# Altium schematic sheet E-scooter.SchDoc
size A4; Organization: Altium Limited; Address1: L3, 12a Rodborough Rd; Address2: Frenchs Forest; Address3: NSW; Address4: Australia 2086
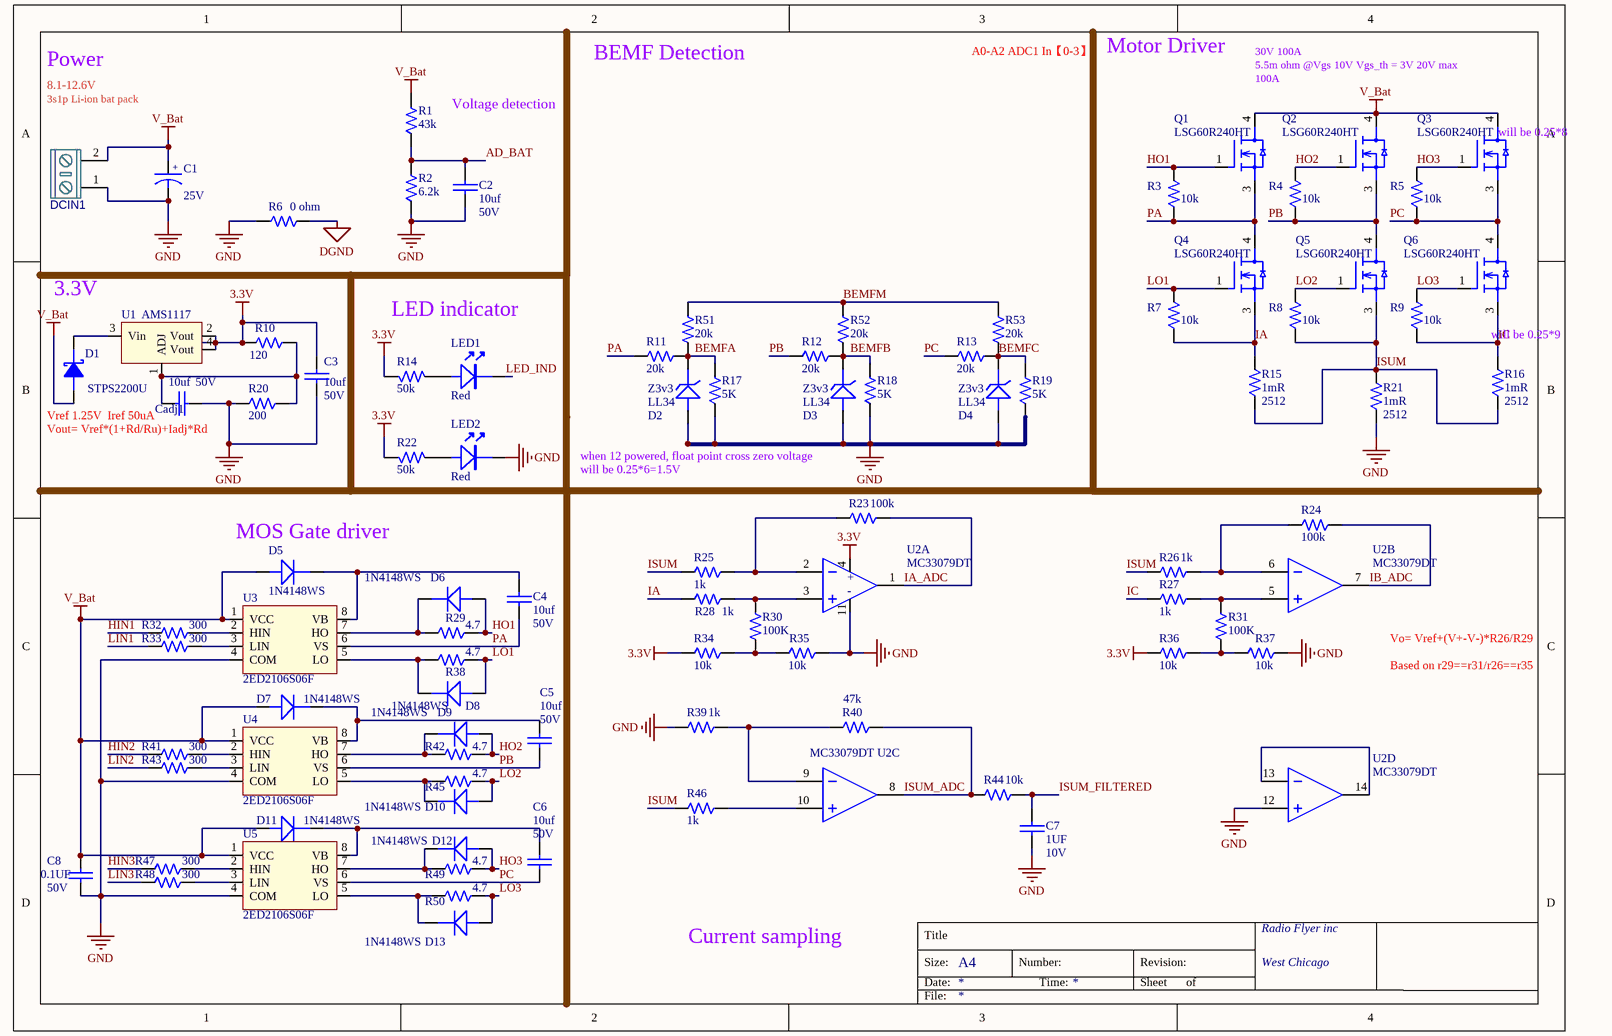
[diagram p0: E-scooter.SchDoc]

## Parts
C1  Voltage: 25V  [CASE - G]  (hidden comment: PBE099550-4710)
C2  value 10uf  Voltage: 50V  [CAPC0603-RW]  (hidden comment: PXL456470-1530)
C3  value 10uf  Voltage: 50V  [CAPC0603-RW]  (hidden comment: PXL456470-1530)
C4  value 10uf  Voltage: 50V  [CAPC0603-RW]  (hidden comment: PXL456470-1530)
C5  value 10uf  Voltage: 50V  [CAPC0603-RW]  (hidden comment: PXL456470-1530)
C6  value 10uf  Voltage: 50V  [CAPC0603-RW]  (hidden comment: PXL456470-1530)
C7  value 1UF  Voltage: 10V  [CAPC0603-SW]  (hidden comment: PXL456470-1530)
C8  value 0.1UF  Voltage: 50V  [CAPC0603-RW]  (hidden comment: PXL456470-1530)
Cadj1  value 10uf  Voltage: 50V  [CAPC0603-RW]  (hidden comment: PXL456470-1530)
D1  MFG Part: STPS2200U  [SMB]  (hidden comment: DIO STPS2200U)
D2  MFG Part: Z3v3  [LL34]  (hidden comment: RCZ005015-0020)
D3  MFG Part: Z3v3  [LL34]  (hidden comment: RCZ005015-0020)
D4  MFG Part: Z3v3  [LL34]  (hidden comment: RCZ005015-0020)
D5  RCD114148-0020  [SOD-323]  (value not drawn)
D6  RCD114148-0020  [SOD-323]  (value not drawn)
D7  RCD114148-0020  [SOD-323]  (value not drawn)
D8  RCD114148-0020  [SOD-323]  (value not drawn)
D9  RCD114148-0020  [SOD-323]  (value not drawn)
D10  RCD114148-0020  [SOD-323]  (value not drawn)
D11  RCD114148-0020  [SOD-323]  (value not drawn)
D12  RCD114148-0020  [SOD-323]  (value not drawn)
D13  RCD114148-0020  [SOD-323]  (value not drawn)
DCIN1  KF/WJ/DG 30x connecter  [KF/WJ/DG 301-2p-5.0mm]  (value not drawn)
LED1  Color: Red  [LED1206-RED]  (hidden comment: LED1206R_23-21\R6C-AM1N2AY\2A)
LED2  Color: Red  [LED1206-RED]  (hidden comment: LED1206R_23-21\R6C-AM1N2AY\2A)
Q1  MFG Part: LSG60R240HT  [TO252-3]  (hidden comment: T5860038503A6)
Q2  MFG Part: LSG60R240HT  [TO252-3]  (hidden comment: T5860038503A6)
Q3  MFG Part: LSG60R240HT  [TO252-3]  (hidden comment: T5860038503A6)
Q4  MFG Part: LSG60R240HT  [TO252-3]  (hidden comment: T5860038503A6)
Q5  MFG Part: LSG60R240HT  [TO252-3]  (hidden comment: T5860038503A6)
Q6  MFG Part: LSG60R240HT  [TO252-3]  (hidden comment: T5860038503A6)
R1  value 43k  [0603-RW]  (hidden comment: T5024421083A9)
R2  value 6.2k  [0603-RW]  (hidden comment: T5024421083A9)
R3  value 10k  [0603-RW]  (hidden comment: T5024421083A9)
R4  value 10k  [0603-RW]  (hidden comment: T5024421083A9)
R5  value 10k  [0603-RW]  (hidden comment: T5024421083A9)
R6  value 0 ohm  [0603-RW]  (hidden comment: T502210202399)
R7  value 10k  [0603-RW]  (hidden comment: T5024421083A9)
R8  value 10k  [0603-RW]  (hidden comment: T5024421083A9)
R9  value 10k  [0603-RW]  (hidden comment: T5024421083A9)
R10  value 120  [0603-RW]  (hidden comment: T5024421083A9)
R11  value 20k  [0603-RW]  (hidden comment: T5024421083A9)
R12  value 20k  [0603-RW]  (hidden comment: T5024421083A9)
R13  value 20k  [0603-RW]  (hidden comment: T5024421083A9)
R14  value 50k  [0603-RW]  (hidden comment: T5024421083A9)
R15  value 1mR  [2512]  (hidden comment: QCF101250-1009)
R16  value 1mR  [2512]  (hidden comment: QCF101250-1009)
R17  value 5K  [0603-RW]  (hidden comment: T5024421083A9)
R18  value 5K  [0603-RW]  (hidden comment: T5024421083A9)
R19  value 5K  [0603-RW]  (hidden comment: T5024421083A9)
R20  value 200  [0603-RW]  (hidden comment: T5024421083A9)
R21  value 1mR  [2512]  (hidden comment: QCF101250-1009)
R22  value 50k  [0603-RW]  (hidden comment: T5024421083A9)
R23  value 100k  [0603-RW]  (hidden comment: T5024421083A9)
R24  value 100k  [0603-RW]  (hidden comment: T5024421083A9)
R25  value 1k  [0603-RW]  (hidden comment: T5024421083A9)
R26  value 1k  [0603-RW]  (hidden comment: T5024421083A9)
R27  value 1k  [0603-RW]  (hidden comment: T5024421083A9)
R28  value 1k  [0603-RW]  (hidden comment: T5024421083A9)
R29  value 4.7  [0603-RW]  (hidden comment: T5024421083A9)
R30  value 100K  [0603-RW]  (hidden comment: T5024421083A9)
R31  value 100K  [0603-RW]  (hidden comment: T5024421083A9)
R32  value 300  [0603-RW]  (hidden comment: T5024421083A9)
R33  value 300  [0603-RW]  (hidden comment: T5024421083A9)
R34  value 10k  [0603-RW]  (hidden comment: T5024421083A9)
R35  value 10k  [0603-RW]  (hidden comment: T5024421083A9)
R36  value 10k  [0603-RW]  (hidden comment: T5024421083A9)
R37  value 10k  [0603-RW]  (hidden comment: T5024421083A9)
R38  value 4.7  [0603-RW]  (hidden comment: T5024421083A9)
R39  value 1k  [0603-RW]  (hidden comment: T5024421083A9)
R40  value 47k  [0603-RW]  (hidden comment: T5024421083A9)
R41  value 300  [0603-RW]  (hidden comment: T5024421083A9)
R42  value 4.7  [0603-RW]  (hidden comment: T5024421083A9)
R43  value 300  [0603-RW]  (hidden comment: T5024421083A9)
R44  value 10k  [0603-RW]  (hidden comment: T5024421083A9)
R45  value 4.7  [0603-RW]  (hidden comment: T5024421083A9)
R46  value 1k  [0603-RW]  (hidden comment: T5024421083A9)
R47  value 300  [0603-RW]  (hidden comment: T5024421083A9)
R48  value 300  [0603-RW]  (hidden comment: T5024421083A9)
R49  value 4.7  [0603-RW]  (hidden comment: T5024421083A9)
R50  value 4.7  [0603-RW]  (hidden comment: T5024421083A9)
R51  value 20k  [0603-RW]  (hidden comment: T5024421083A9)
R52  value 20k  [0603-RW]  (hidden comment: T5024421083A9)
R53  value 20k  [0603-RW]  (hidden comment: T5024421083A9)
U1  AMS1117  [SOT223]
U2  RCI033079-0002  [SO14]  (value not drawn)  (parts A,B,C,D of 4)
U3  T610900027257  [SO8]  (value not drawn)
U4  T610900027257  [SO8]  (value not drawn)
U5  T610900027257  [SO8]  (value not drawn)

## Nets
3.3V: C3.1 R10.2 R14.1 R22.1 R34.2 R36.2 U1.2(Vout) U1.4(Vout) U2.4(+V)
DGND: R6.2
GND: C1.2 C2.2 C3.2 C7.1 C8.1 Cadj1.2 D2.1(A) D3.1(A) D4.1(A) DCIN1.1 LED2.2(K) R2.2 R6.1 R17.2 R18.2 R19.2 R20.2 R21.1 R35.1 R37.1 R39.2 U2.11(-V) U2.12(IN+) U3.4(COM) U4.4(COM) U5.4(COM)
V_Bat: C1.1 C8.2 D1.1(A) D5.1(A) D7.1(A) D11.1(A) DCIN1.2 Q1.4(D) Q2.4(D) Q3.4(D) R1.1 U3.1(VCC) U4.1(VCC) U5.1(VCC)
AD_BAT: C2.1 R1.2 R2.1
BEMFA: D2.2(K) R11.1 R17.1 R51.2
BEMFB: D3.2(K) R12.1 R18.1 R52.2
BEMFC: D4.2(K) R13.1 R19.1 R53.2
BEMFM: R51.1 R52.1 R53.1
HIN1: R32.2
HIN2: R41.2
HIN3: R47.2
HO1: D6.1(A) Q1.1(G) R3.2 R29.1
HO2: D9.1(A) Q2.1(G) R4.2 R42.1
HO3: D12.1(A) Q3.1(G) R5.2 R49.1
IA: Q4.3(S) R7.1 R15.2 R28.2
IA_ADC: R23.1 U2.1(OUT)
IB_ADC: R24.1 U2.7(OUT)
IC: Q6.3(S) R9.1 R16.2 R27.2
ISUM: Q5.3(S) R8.1 R15.1 R16.1 R21.2 R25.2 R26.2 R46.2
ISUM_ADC: R40.1 R44.2 U2.8(OUT)
ISUM_FILTERED: C7.2 R44.1
LED_IND: LED1.2(K)
LIN1: R33.2
LIN2: R43.2
LIN3: R48.2
LO1: D8.1(A) Q4.1(G) R7.2 R38.1
LO2: D10.1(A) Q5.1(G) R8.2 R45.1
LO3: D13.1(A) Q6.1(G) R9.2 R50.1
PA: C4.1 Q1.3(S) Q4.4(D) R3.1 R11.2 U3.6(VS)
PB: C5.1 Q2.3(S) Q5.4(D) R4.1 R12.2 U4.6(VS)
PC: C6.1 Q3.3(S) Q6.4(D) R5.1 R13.2 U5.6(VS)
NetC4_2: C4.2 D5.2(K) U3.8(VB)
NetC5_2: C5.2 D7.2(K) U4.8(VB)
NetC6_2: C6.2 D11.2(K) U5.8(VB)
NetCadj1_1: Cadj1.1 R10.1 R20.1 U1.1(ADJ)
NetD1_2: D1.2(K) U1.3(Vin)
NetD6_2: D6.2(K) R29.2 U3.7(HO)
NetD8_2: D8.2(K) R38.2 U3.5(LO)
NetD9_2: D9.2(K) R42.2 U4.7(HO)
NetD10_2: D10.2(K) R45.2 U4.5(LO)
NetD12_2: D12.2(K) R49.2 U5.7(HO)
NetD13_2: D13.2(K) R50.2 U5.5(LO)
NetLED1_1: LED1.1(A) R14.2
NetLED2_1: LED2.1(A) R22.2
NetR23_2: R23.2 R25.1 U2.2(IN-)
NetR24_2: R24.2 R26.1 U2.6(IN-)
NetR27_1: R27.1 R31.1 U2.5(IN+)
NetR28_1: R28.1 R30.1 U2.3(IN+)
NetR30_2: R30.2 R34.1 R35.2
NetR31_2: R31.2 R36.1 R37.2
NetR32_1: R32.1 U3.2(HIN)
NetR33_1: R33.1 U3.3(LIN)
NetR39_1: R39.1 R40.2 U2.9(IN-)
NetR41_1: R41.1 U4.2(HIN)
NetR43_1: R43.1 U4.3(LIN)
NetR46_1: R46.1 U2.10(IN+)
NetR47_1: R47.1 U5.2(HIN)
NetR48_1: R48.1 U5.3(LIN)
NetU2_13: U2.13(IN-) U2.14(OUT)

## Notes on the sheet
- Power
- 3s1p Li-ion bat pack
- 8.1-12.6V
- (near R1) Voltage detection
- BEMF Detection
- A0-A2 ADC1 In【0-3】
- Motor Driver
- 30V 100A
- 5.5m ohm @Vgs 10V Vgs_th = 3V 20V max
- (near Q1) 100A
- (near Q3) will be 0.25*8
- 3.3V
- LED indicator
- will be 0.25*9
- (near Cadj1) Vref 1.25V  Iref 50uA
- Vout= Vref*(1+Rd/Ru)+Iadj*Rd
- when 12 powered, float point cross zero voltage
- will be 0.25*6=1.5V
- (near D5) MOS Gate driver
- Vo= Vref+(V+-V-)*R26/R29
- Based on r29==r31/r26==r35
- Current sampling
- Title
- Size:
- Date:
- A4
- Number:
- Time:
- Revision:
- Sheet
- of
- Radio Flyer inc
- West Chicago
- File:
- (in symbol CAP E 470uF 25V 20% SMD) +
- (in symbol MC33079DT, part A) +; -

## Library data of the parts
C1 = CAP E 470uF 25V 20% SMD: CHIP ELECT 470uF 25V 20% D10xL10 105; SAP: T551471445000; Vendor Name: 东莞市晴远电子有限公司; Vendor Code: 10010262; Type: Capacitor; DIP&SMD: SMD; PACKAGE: CASE - G; MFG: *; MFG Part: *; Other: *; Tolerance: 20%; Customer Specific: N/A
C2-C8 = CAP0603 0.015uF 50V 10%: GP CHIP CAP 0.015uF 50V 10% 0603 TYPE X7R; SAP: T542021537508; Vendor Code: 10010262; Vendor Name: 东莞市晴远电子有限公司; Type: Capacitor; DIP&SMD: SMD; PACKAGE: CAPC0603; MFG: *; MFG Part: *; Other: X7R; Tolerance: 10%; Customer Specific: N/A
Cadj1 = CAP0603 0.015uF 50V 10%: GP CHIP CAP 0.015uF 50V 10% 0603 TYPE X7R; SAP: T542021537508; Vendor Code: 10010262; Vendor Name: 东莞市晴远电子有限公司; DIP&SMD: SMD; PACKAGE: CAPC0603; MFG: *; MFG Part: *; Other: X7R; Tolerance: 10%; Type: Capacitor; Customer Specific: N/A
D1 = DIO STPS2200U: DIODE SCHOTTKY 200V 2A SMB; MFG: STMicroelectronics; DIP&SMD: SMD; CREATE_NAME: Nathan; SAP: *; Vendor Name: *; Vendor Code: *; Voltage: *; Current: *; Type: DIODE; Customer Specific: N/A; CREATE_TIME: 19-Jun-2020; Package: SMB
D2-D4 = TCLLZ15V: CHIP ZENER 15V 0.5W MLL34; SAP: T573003832016; Vendor Code: 10009207; Vendor Name: MOBICON HOLDINGS LTD.; MFG: TAK CHEONG; Current: 5MA; Tolerance: 5%; Power: 500MW; DIP&SMD: SMD; VOLTAGE: 15V; Type: ZENER; Customer Specific: N/A; Package: LL34
D5-D13 = 1N4148WS: DIODE SW 1N4148 VF=0.7V SOD-323; MFG: TW SEMICONDUCTOR; SAP: T572005070208; Voltage: 100V; Current: 150MA; DIP&SMD: SMD; Vendor Name: *; Vendor Code: *; Type: DIODE; Package: SOD-323; Customer Specific: N/A; MFG Part: 1N4148WS
DCIN1 = KF/WJ/DG 30x: 接线端子 2Pin
LED1 LED2 = LED1206R_23-21\R6C-AM1N2AY\2A: CHIP LED RED TYPE 1206; MFG: EVERLIGHT; DIP&SMD: SMD; CREATE_NAME: Nathan; MFG Part: 23-21\R6C-AM1N2AY\2A; SAP: *; Package: 1206; Type: LED; CREATE_TIME: 18-Aug-2020
Q1-Q6 = NMOS LSG60R240HT: NMOS 600V LSG60R240HT TO252( LONTEN K; Current: 17A; Type: N-CHANNEL MOSFET; CREATE_NAME: Nathan; DIP&SMD: SMD; SAP: T5860038503A6; Pd: *; Vendor Code: *; Vendor Name: *; Voltage: 600V; MFG: LONTEN; CREATE_TIME: 12-Oct-2019; Rds: *; Customer Specific: N/A; Package: TO252
R1-R5 R7-R14 R17-R20 R22-R53 = RES0201 1/20W 1% 4.42K OHM_WALSIN: CHIP 4.42K OHM 200PPM +-1% 0201 WALS L; MFG Part: WR02X4421FAL; Power: 1/20W; MFG: WALSIN (華新); TOL: 1%; CREATE_NAME: Nathan; DIP&SMD: SMD; Vendor Code: *; SAP: T5024421083A9; Vendor Name: *; Type: Resistor; PACKAGE: 0603; CREATE_TIME: 23-July-2019; Customer Specific: N/A
R6 = RES0603 1/16W 1% 21K OMH_WALSIN: CHIP 21K OHM 100PPM +-1% 0603 WALS L; TOL: 1%; MFG: WALSIN (華新); Power: 1/10W; CREATE_NAME: Nathan; DIP&SMD: SMD; SAP: T502210202399; Package: 0603; MFG Part: *; Vendor Code: *; Vendor Name: *; Type: Resistor; CREATE_TIME: 08-Feb-2018; Customer Specific: N/A
R15 R16 R21 = RES2512 1W 1% 10 OHM: CHIP RES. 10 OHM 1W 1% 2512; Vendor Code: 10010262; SAP: T502100A07399; Vendor Name: 东莞市晴远电子有限公司; DIP&SMD: SMD; Power: 1W; MFG Part: *; MFG: *; TOL: 1%; Type: Resistor; Customer Specific: N/A; PACKAGE: 2512
U1 = AMS1117: 800mA LOW DROPOUT VOLTAGE REGULATOR , SOT-223; MFG: Advanced Monolithic Systems; CREATE_NAME: Nathan; DIP&SMD: SMD; SAP: *; Vendor Code: *; Vendor Name: *; Type: IC; CREATE_TIME: 17-Nov-2020; Package: SOT-223; Customer Specific: N/A; MFG Part: AMS1117
U2 = MC33079DT: IC opamp quad MC33079 bipolar SO14; SAP: T610500026102; MFG: STMICROELECTRONICS; DIP&SMD: SMD; Vendor Code: *; Vendor Name: *; Type: IC; Customer Specific: N/A; MFG Part: MC33079DT
U3-U5 = 2ED2106S06F: DRIVER 2ED2106S06F DSO-8 INFINEO K; MFG: Infineon; CREATE_NAME: Nathan; DIP&SMD: SMD; Vendor Code: *; Vendor Name: *; SAP: T610900027257; Type: IC; CREATE_TIME: 14-Apr-2020; Customer Specific: N/A; MFG Part: 2ED2106S06F